# EAGLE schematic Y-babies -- PicAxe (EAGLE 6.5.0)
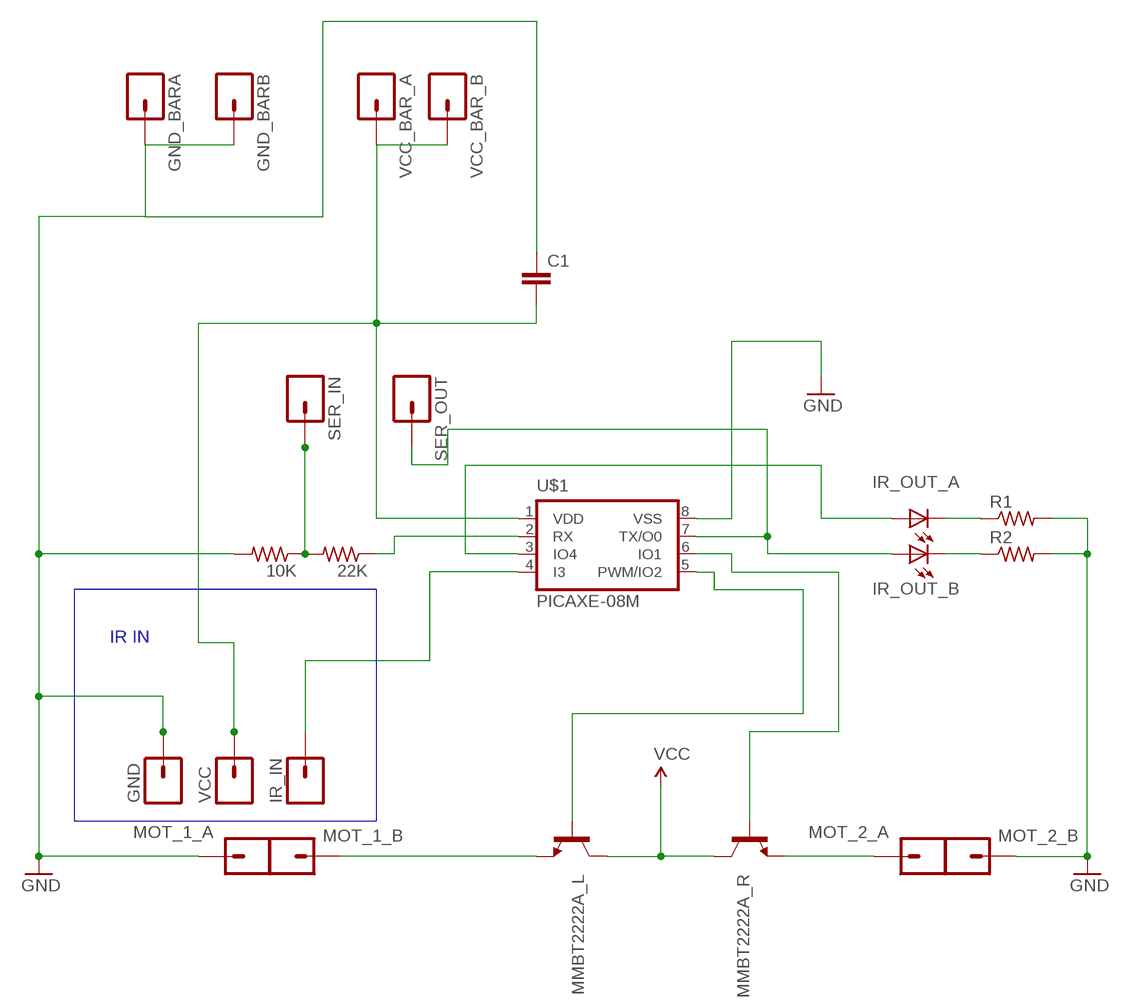
[diagram p0: schematic, sheet 1]

## Parts
10K  R-US_R0805W  [R0805W]
22K  R-US_R0805W  [R0805W]
C1  CAPPTH1  [CAP-PTH-5MM]
GND  M01PTH  [1X01]
GND_BARA  M01PTH  [1X01]
GND_BARB  M01PTH  [1X01]
IR_IN  M01PTH  [1X01]
IR_OUT_A  LED3MM  [LED3MM]
IR_OUT_B  LED3MM  [LED3MM]
MMBT2222A_L  TRANSISTOR_NPNSOT23  [SOT23]
MMBT2222A_R  TRANSISTOR_NPNSOT23  [SOT23]
MOT_1_A  M01SMD-4.5X1.5  [PAD-1.5X4.5]
MOT_1_B  M01SMD-4.5X1.5  [PAD-1.5X4.5]
MOT_2_A  M01SMD-4.5X1.5  [PAD-1.5X4.5]
MOT_2_B  M01SMD-4.5X1.5  [PAD-1.5X4.5]
R1  R-US_R0805W  [R0805W]
R2  R-US_R0805W  [R0805W]
SER_IN  M01PTH  [1X01]
SER_OUT  M01PTH  [1X01]
U$1  PICAXE-08M  [DIL8]
VCC  M01PTH  [1X01]
VCC_BAR_A  M01PTH  [1X01]
VCC_BAR_B  M01PTH  [1X01]

## Nets
GND: 10K.2 C1.1 GND.1 GND_BARA.1 GND_BARB.1 MOT_1_A.P$1 MOT_2_B.P$1 R1.2 R2.2 U$1.8(VSS)
N$1: MMBT2222A_L.1(B) U$1.5(PWM/IO2)
N$2: MMBT2222A_R.1(B) U$1.6(IO1)
N$3: IR_OUT_B.A SER_OUT.1 U$1.7(TX/O0)
N$4: IR_OUT_B.K(C) R2.1
N$5: 10K.1 22K.2 SER_IN.1
N$6: IR_OUT_A.A U$1.3(IO4)
N$7: IR_OUT_A.K(C) R1.1
N$8: 22K.1 U$1.2(RX)
N$9: MMBT2222A_L.2(E) MOT_1_B.P$1
N$10: MMBT2222A_R.2(E) MOT_2_A.P$1
N$11: IR_IN.1 U$1.4(I3)
VCC: C1.2 MMBT2222A_L.3(C) MMBT2222A_R.3(C) U$1.1(VDD) VCC.1 VCC_BAR_A.1 VCC_BAR_B.1

## Buses
B$1

## Notes on the sheet
- IR IN

## Library data of the parts
10K 22K R1 R2 = resistor:R-US_: RESISTOR, American symbol
C1 = SparkFun:CAP: Capacitor Standard 0603 ceramic capacitor, and 0.1" leaded capacitor.
GND GND_BARA GND_BARB IR_IN MOT_1_A MOT_1_B MOT_2_A MOT_2_B SER_IN SER_OUT VCC VCC_BAR_A VCC_BAR_B = SparkFun:M01: Header 1 Standard 1-pin 0.1" header. Use with straight break away headers (SKU : PRT-00116), right angle break away headers (PRT-00553), swiss pins (PRT-00743), machine pins (PRT-00117), and female headers (PRT-00115).
IR_OUT_A IR_OUT_B = led:LED: LED OSRAM: - CHIPLED LG R971, LG N971, LY N971, LG Q971, LY Q971, LO R971, LY R971 LH N974, LH R974 LS Q976, LO Q976, LY Q976 LO Q996 - Hyper CHIPLED LW Q18S LB Q993, LB Q99A, LB R99A - SideLED LS A670, LO A670, LY A670, LG A670, LP A670 LB A673, LV A673, LT A673, LW A673 LH A674 LY A675 LS A676, LA A676, LO A676, LY A676, LW A676 LS A679, LY A679, LG A679 - Hyper Micro SIDELED® LS Y876, LA Y876, LO Y876, LY Y876 LT Y87S - SmartLED LW L88C, LW L88S LB L89C, LB L89S, LG L890 LS L89K, LO L89K, LY L89K LS L896, LA L896, LO L896, LY L896 - TOPLED LS T670, LO T670, LY T670, LG T670, LP T670 LSG T670, LSP T670, LSY T670, LOP T670, LYG T670 LG T671, LOG T671, LSG T671 LB T673, LV T673, LT T673, LW T673 LH T674 LS T676, LA T676, LO T676, LY T676, LB T676, LH T676, LSB T676, LW T676 LB T67C, LV T67C, LT T67C, LS T67K, LO T67K, LY T67K, LW E67C LS E67B, LA E67B, LO E67B, LY E67B, LB E67C, LV E67C, LT E67C LW T67C LS T679, LY T679, LG T679 LS T770, LO T770, LY T770, LG T770, LP T770 LB T773, LV T773, LT T773, LW T773 LH T774 LS E675, LA E675, LY E675, LS T675 LS T776, LA T776, LO T776, LY T776, LB T776 LHGB T686 LT T68C, LB T68C - Hyper Mini TOPLED® LB M676 - Mini TOPLED Santana® LG M470 LS M47K, LO M47K, LY M47K Source: http://www.osram.convergy.de LUXEON: - LUMILED® LXK2-PW12-R00, LXK2-PW12-S00, LXK2-PW14-U00, LXK2-PW14-V00 LXK2-PM12-R00, LXK2-PM12-S00, LXK2-PM14-U00 LXK2-PE12-Q00, LXK2-PE12-R00, LXK2-PE12-S00, LXK2-PE14-T00, LXK2-PE14-U00 LXK2-PB12-K00, LXK2-PB12-L00, LXK2-PB12-M00, LXK2-PB14-N00, LXK2-PB14-P00, LXK2-PB14-Q00 LXK2-PR12-L00, LXK2-PR12-M00, LXK2-PR14-Q00, LXK2-PR14-R00 LXK2-PD12-Q00, LXK2-PD12-R00, LXK2-PD12-S00 LXK2-PH12-R00, LXK2-PH12-S00 LXK2-PL12-P00, LXK2-PL12-Q00, LXK2-PL12-R00 Source: www.luxeon.com KINGBRIGHT: KA-3528ASYC Source: www.kingbright.com
MMBT2222A_L MMBT2222A_R = SparkFun:TRANSISTOR_NPN: Transistor NPN BJT configuration in SOT23 package. MMBT2222 is the common NPN we use. Double check BCE configuration again layout.
U$1 = picaxe-3:PICAXE-08M